# Altium schematic sheet ad7768.SchDoc
size A4; SheetNumber: 1; SheetTotal: 4
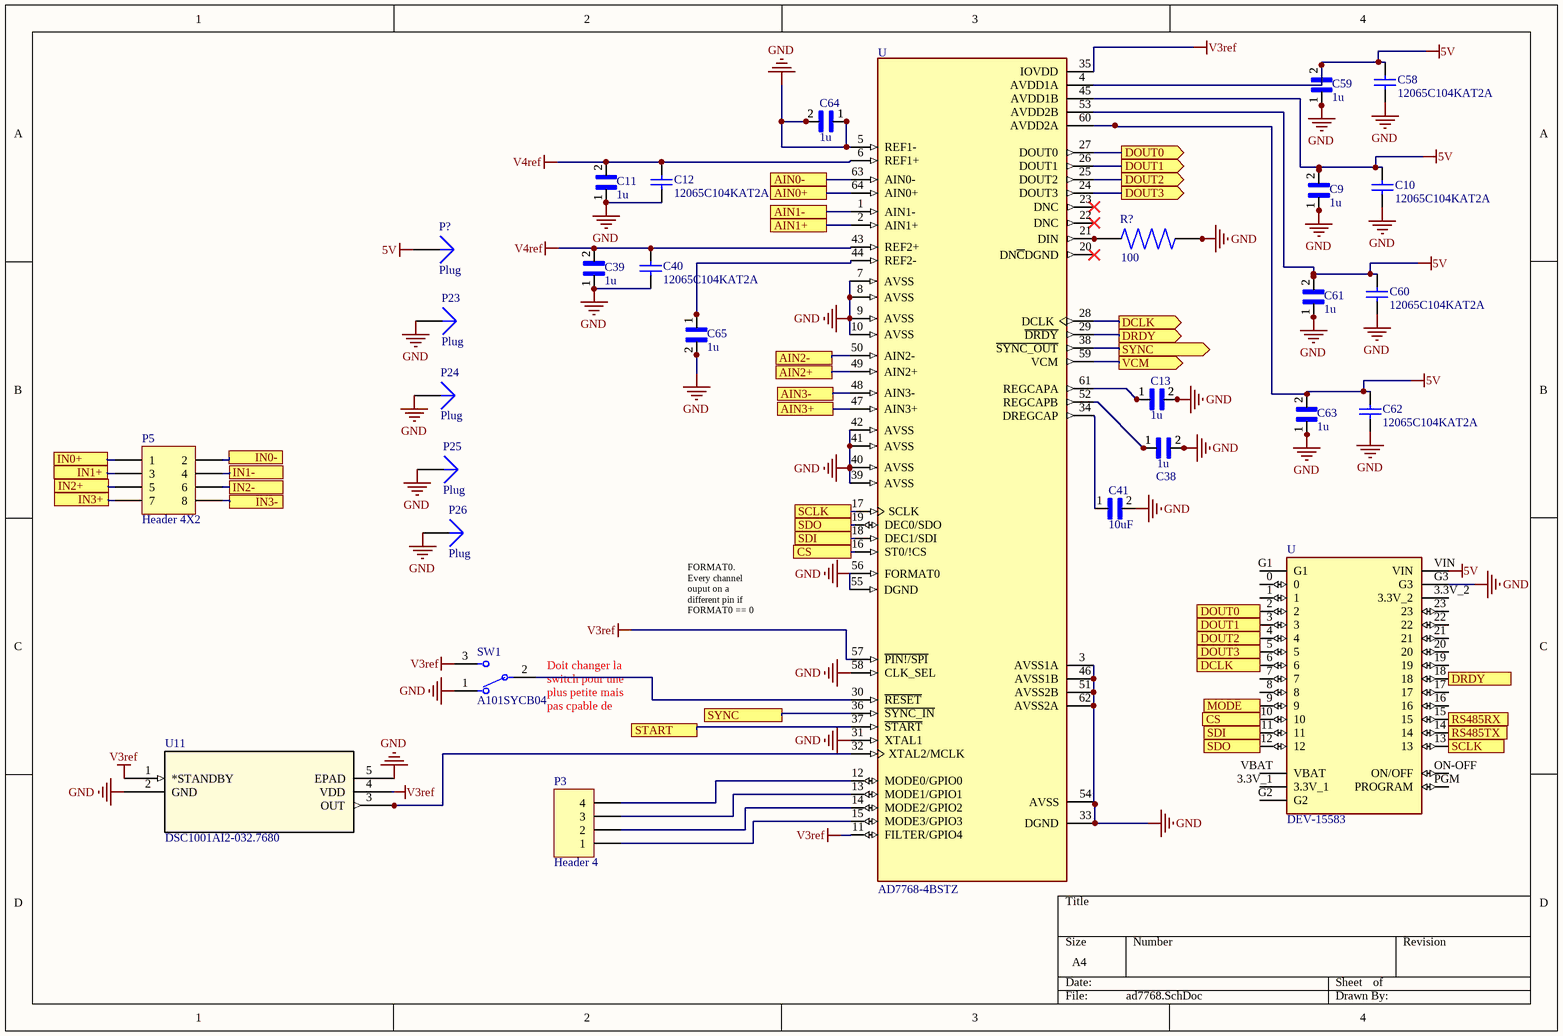
[diagram p0: ad7768.SchDoc]

## Parts
(Parts that share a designator on the sheet are numbered #1, #2 ... from top to bottom, then left to right.)
C9  1u  [CAPC3216X127N]
C10  12065C104KAT2A  [CAPC3216X94X50ML20T25]
C11  1u  [CAPC3216X127N]
C12  12065C104KAT2A  [CAPC3216X94X50ML20T25]
C13  1u  [CAPC3216X127N]
C38  1u  [CAPC3216X127N]
C39  1u  [CAPC3216X127N]
C40  12065C104KAT2A  [CAPC3216X94X50ML20T25]
C41  10uF  [CAPC3216X178N]
C58  12065C104KAT2A  [CAPC3216X94X50ML20T25]
C59  1u  [CAPC3216X127N]
C60  12065C104KAT2A  [CAPC3216X94X50ML20T25]
C61  1u  [CAPC3216X127N]
C62  12065C104KAT2A  [CAPC3216X94X50ML20T25]
C63  1u  [CAPC3216X127N]
C64  1u  [CAPC3216X127N]
C65  1u  [CAPC3216X127N]
P3  Header 4  [HDR1X4]
P5  Header 4X2  [HDR2X4]
P23  Plug  [PIN1]
P24  Plug  [PIN1]
P25  Plug  [PIN1]
P26  Plug  [PIN1]
P?  Plug  [PIN1]
R?  100  [RESC3116X75N]
SW1  A101SYCB04  [FP-A101SYCB04-MFG]
U11  DSC1001AI2-032.7680  [DFN4_7X5_MCH]
U#1  AD7768-4BSTZ  [QFP50P1200X1200X160-64N]
U#2  DEV-15583  [MODULE_DEV-15583]

## Ports
AIN0+, AIN0-, AIN1+, AIN1-, AIN2+, AIN2-, AIN3+, AIN3-, CS, DCLK (out), DOUT0 (out), DOUT1 (out), DOUT2 (out), DOUT3 (out), DRDY (out), IN0+, IN0-, IN1+, IN1-, IN2+, IN2-, IN3+, IN3-, MODE, RS485RX, RS485TX, SCLK, SDI, SDO, START, SYNC, SYNC (out), VCM (out)

## Nets
5V: C9.2 C10.1 C58.1 C59.2 C60.1 C61.2 C62.1 C63.2 P?.1 U#1.4(AVDD1A) U#1.45(AVDD1B) U#1.53(AVDD2B) U#1.60(AVDD2A) U#2.VIN
GND: C9.1 C10.2 C11.1 C12.2 C13.2 C38.2 C39.1 C40.2 C41.2 C58.2 C59.1 C60.2 C61.1 C62.2 C63.1 C64.1 C64.2 C65.2 P23.1 P24.1 P25.1 P26.1 R?.2 SW1.1 U11.2(GND) U11.5(EPAD) U#1.3(AVSS1A) U#1.5(REF1-) U#1.7(AVSS) U#1.8(AVSS) U#1.9(AVSS) U#1.10(AVSS) U#1.31(XTAL1) U#1.33(DGND) U#1.39(AVSS) U#1.40(AVSS) U#1.41(AVSS) U#1.42(AVSS) U#1.46(AVSS1B) U#1.51(AVSS2B) U#1.54(AVSS) U#1.55(DGND) U#1.56(FORMAT0) U#1.58(CLK_SEL) U#1.62(AVSS2A) U#2.G3
V3ref: SW1.3 U11.1(*STANDBY) U11.4(VDD) U#1.11(FILTER/GPIO4) U#1.35(IOVDD) U#1.57(~{PIN!/SPI})
V4ref: C11.2 C12.1 C39.2 C40.1 U#1.6(REF1+) U#1.43(REF2+)
AIN0+: U#1.64(AIN0+) ; port AIN0+
AIN0-: U#1.63(AIN0-) ; port AIN0-
AIN1+: U#1.2(AIN1+) ; port AIN1+
AIN1-: U#1.1(AIN1-) ; port AIN1-
AIN2+: U#1.49(AIN2+) ; port AIN2+
AIN2-: U#1.50(AIN2-) ; port AIN2-
AIN3+: U#1.47(AIN3+) ; port AIN3+
AIN3-: U#1.48(AIN3-) ; port AIN3-
CS: U#1.16(ST0/!CS) U#2.10 ; port CS
DCLK: U#1.28(DCLK) U#2.6 ; port DCLK
DOUT0: U#1.27(DOUT0) U#2.2 ; port DOUT0
DOUT1: U#1.26(DOUT1) U#2.3 ; port DOUT1
DOUT2: U#1.25(DOUT2) U#2.4 ; port DOUT2
DOUT3: U#1.24(DOUT3) U#2.5 ; port DOUT3
DRDY: U#1.29(~{DRDY}) U#2.18 ; port DRDY
IN0+: P5.1 ; port IN0+
IN0-: P5.2 ; port IN0-
IN1+: P5.3 ; port IN1+
IN1-: P5.4 ; port IN1-
IN2+: P5.5 ; port IN2+
IN2-: P5.6 ; port IN2-
IN3+: P5.7 ; port IN3+
IN3-: P5.8 ; port IN3-
MODE: U#2.9 ; port MODE
RS485RX: U#2.15 ; port RS485RX
RS485TX: U#2.14 ; port RS485TX
SCLK: U#1.17(SCLK) U#2.13 ; port SCLK
SDI: U#1.18(DEC1/SDI) U#2.11 ; port SDI
SDO: U#1.19(DEC0/SDO) U#2.12 ; port SDO
START: U#1.37(~{START}) ; port START
SYNC: U#1.36(~{SYNC_IN}) U#1.38(~{SYNC_OUT}) ; port SYNC
VCM: U#1.59(VCM) ; port VCM
NetC13_1: C13.1 U#1.61(REGCAPA)
NetC38_1: C38.1 U#1.52(REGCAPB)
NetC41_1: C41.1 U#1.34(DREGCAP)
NetC65_1: C65.1 U#1.44(REF2-)
NetP3_1: P3.1 U#1.15(MODE3/GPIO3)
NetP3_2: P3.2 U#1.14(MODE2/GPIO2)
NetP3_3: P3.3 U#1.13(MODE1/GPIO1)
NetP3_4: P3.4 U#1.12(MODE0/GPIO0)
NetR?_1: R?.1 U#1.21(DIN)
NetSW1_2: SW1.2 U#1.30(~{RESET})
NetU11_3: U11.3(OUT) U#1.32(XTAL2/MCLK)

Not connected (* = marked no-connect by the designer): U#1 20(DN~{C}DGND)* 22(DNC)* 23(DNC)*; U#2 0 1 3.3V_1 3.3V_2 7 8 16 17 19 20 21 22 23 G1 G2 ON-OFF(ON/OFF) PGM(PROGRAM) VBAT

## Notes on the sheet
- FORMAT0. Every channel ouput on a different pin if FORMAT0 == 0
- (near SW1) Doit changer la switch pour une plus petite mais pas cpable de trouver

## Library data of the parts
C9 C11 C13 C38 C39 C59 C61 C63-C65 = 1206YC105KAT2A: Cap Ceramic 1uF 16V X7R 10% SMD 1206 125ÂÂŽ T/R; MF: {'manufacturer': u'AVX'}; Value: *; Package: None; MP: 1206YC105KAT2A; Price: None; Availability: Unavailable
C10 C12 C40 C58 C60 C62 = CMP-2000-05018-1: Chip Capacitor, Ceramic, 100 nF, 10%, 50 V, 1206, RoHS, Tape and Reel; Manufacturer: AVX; Rated Voltage: 50V; Dielectric: X7R; Capacitance: 100nF; Datasheet URL: http://www.mouser.com/ds/2/40/cauto-360.pdf; Manufacturer URL: http://www.avx.com/; Datasheet Version: Sep-14; Tolerance (%): ±10%; Case Size/Dimension: 1206
C41 = 1206ZC106KAT2A: CAPACITOR, MLCC, X7R, 10UF, 10V, 1206; MF: {'manufacturer': u'AVX'}; Value: *; Price: None; Availability: Unavailable; MP: 1206ZC106KAT2A; Package: None
P3 = Header 4: Header, 4-Pin; LatestRevisionDate: 17-Jul-2002; LatestRevisionNote: Re-released for DXP Platform.; Publisher: Altium Limited
P5 = Header 4X2: Header, 4-Pin, Dual row; LatestRevisionDate: 17-Jul-2002; LatestRevisionNote: Re-released for DXP Platform.; Publisher: Altium Limited
R? = RTAN1206BKE33R0: MF: {'manufacturer': u'Stackpole Electronics Inc'}; Value: *; Package: None; MP: RTAN1206BKE33R0; Price: None; Availability: Unavailable
SW1 = CMP-03408-000017-1: SWITCH TOGGLE SPDT 0.4VA 20V; Electrical Life: 6000Cycles; Number of Poles: 1; Power Rating: 400mW; Switch Function: On-On; Contact Resistance: 10mR; Contact Current Rating: 400mA; Actuator Material: Phenolic; Insulation Resistance: 30MR; Actuator Color: Chrome; Number of Positions: 2; Actuator Type: Standard Round; Actuator Length: 10.41mm; Illumination Type: Non-Illuminated; Flammability Rating: UL94 V-1; Contact Material: Copper; Depth: 6.86mm; Contact Plating: Gold; Voltage Rating (AC): 20V; Max Voltage Rating (DC): 20V; Min Operating Temperature: -30°C; Max Operating Temperature: 85°C; Throw Configuration: SPDT; Packaging: Bulk; Termination: PC Pins; Series: Gemini A; ELV: Compliant; Lead Free: Lead Free; RoHS Compliant: Yes; REACH SVHC: No SVHC; Mount: Panel; Orientation: Straight; Package Quantity: 100; Max Voltage Rating (AC): 20V; Radiation Hardening: No; Voltage Rating (DC): 20V
U11 = DSC1001AI2-032.7680: No Description Available; Mfr_Name: Microchip; Copyright: Copyright (C) 2021 Ultra Librarian. All rights reserved.; Manufacturer_Part_Number: DSC1001AI2-032.7680; Digi-Key_Part_Number_1: DSC1001AI2-032.7680-ND; RefDes: RefDes; Type: DEV
U#1 = AD7768-4BSTZ: 24 Bit Analog to Digital Converter 4 Input 4 Sigma-Delta 64-LQFP _10x10_; MF: Analog Devices; Digi-Key_Purchase_URL: https://www.digikey.com/product-detail/en/analog-devices-inc/AD7768-4BSTZ/AD7768-4BSTZ-ND/6072260?utm_source=snapeda&utm_medium=aggregator&utm_campaign=symbol; Package: LQFP -64 Analog Devices; SnapEDA_Link: https://www.snapeda.com/parts/AD7768-4BSTZ/Analog%20Devices%20Inc./view-part/501603/?ref=snap; Value: *; MP: AD7768-4BSTZ; Digi-Key_Part_Number: AD7768-4BSTZ-ND
U#2 = DEV-15583: RT1062 Teensy 4.0 i.MX ARMÂ® CortexÂ®-M7 MPU Embedded Evaluation Board; MF: SparkFun Electronics; Value: *; Package: None; Digi-Key_Part_Number: 1568-DEV-15583-ND; Digi-Key_Purchase_URL: https://www.digikey.com/product-detail/en/sparkfun-electronics/DEV-15583/1568-DEV-15583-ND/10384551?utm_source=snapeda&utm_medium=aggregator&utm_campaign=symbol; MP: DEV-15583; SnapEDA_Link: https://www.snapeda.com/parts/DEV-15583/SparkFun%20Electronics/view-part/4001229/?ref=snap
P23-P26 P? = Plug: LatestRevisionDate: 17-Jul-2002; LatestRevisionNote: Re-released for DXP Platform.; Publisher: Altium Limited